# Altium schematic sheet iir_loader.SchDoc
size A3; SheetNumber: 1; SheetTotal: 2
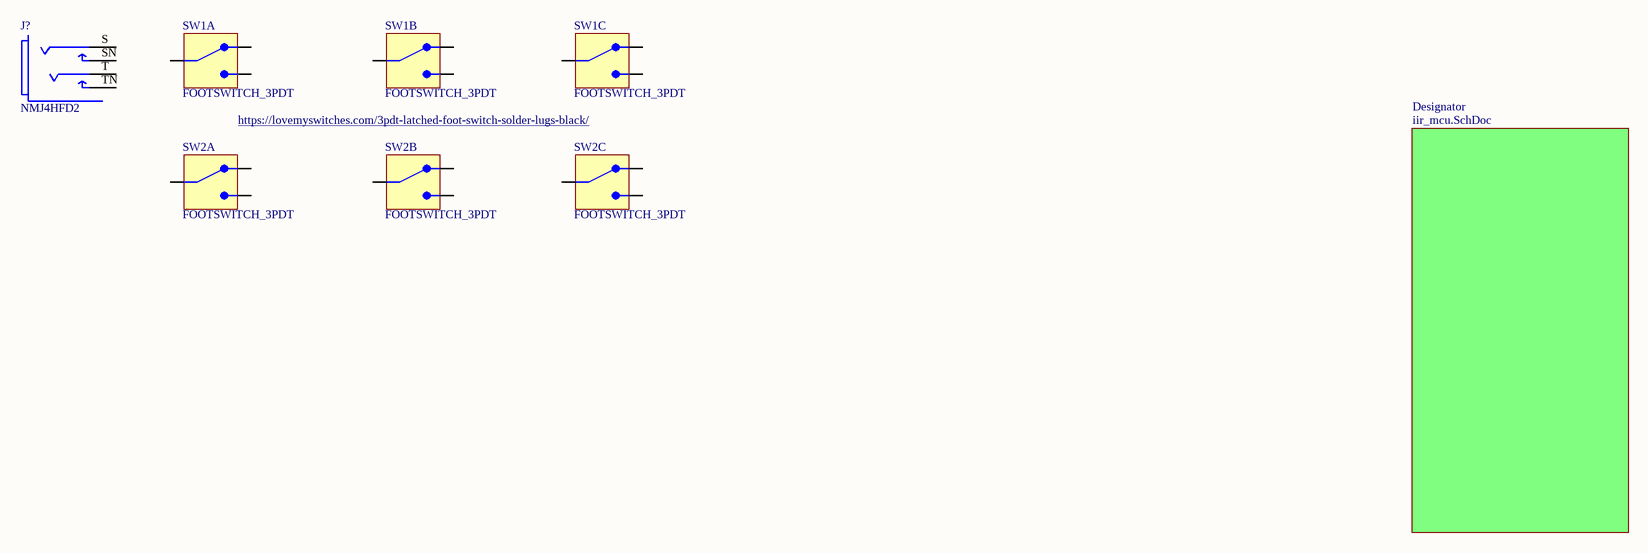
[diagram p0: iir_loader.SchDoc]

## Parts
J?  NMJ4HFD2  [FP-NMJ4HFD2-MFG]
SW1  FOOTSWITCH_3PDT  [FOOTSWITCH_3PDT]  (parts A,B,C of 3)
SW2  FOOTSWITCH_3PDT  [FOOTSWITCH_3PDT]  (parts A,B,C of 3)

## Sub-sheets
Designator = iir_mcu.SchDoc: no entries

## Nets

Not connected (* = marked no-connect by the designer): J? S SN T TN; SW1 COM1 COM2 COM3 NC1 NC2 NC3 NO1 NO2 NO3; SW2 COM1 COM2 COM3 NC1 NC2 NC3 NO1 NO2 NO3

## Library data of the parts
J? = CMP-78736-000001-1: Conn 1/4" Mono Jack F 3 POS Solder RA Thru-Hole 3 Terminal 1 Port; Manufacturer: Neutrik; Number Of Contacts: 2; Current Rating: 0.5A; Voltage Rating: 50V; Conn Orientation: Horizontal; Is Female: yes; Temperature: -25°C to +70°C; ComponentLink2Description: Datasheet; ComponentLink2URL: https://www.neutrik.com/en/product/nmj4hfd2.pdf; Contact Material: Silver; Height: 15.89mm; Package: 0; Mouser Description: Phone Audio Connector, Socket, 2, PCB Mount, Metal Body, Silver Plated Contacts; Manufacturer Part Number: NMJ4HFD2; Automotive: No; RoHS: TRUE; Lead Free: Yes; Device Class L2: Audio / Video Connectors; Device Class L3: unset; Temperature Range Low: -25°C; Category: Conn; Footprint Url: https://www.neutrik.com/media/8576/download/st-nmj4hfd2.pdf?v=1; Temperature Range High: +70°C; Device Class L1: Connectors; Octopart: https://octopart.com/nmj4hfd2-neutrik-758952
SW1 SW2 = FOOTSWITCH_3PDT: Generic 3PDT Footswitch; Manufacturer: *; Manufacturer Part Number: *; Link: https://lovemyswitches.com/3pdt-latched-foot-switch-solder-lugs-black/